# Altium schematic sheet Smartfin Main PCBA GPS.SchDoc: GPS
size Tabloid; TOCFontName: Consolas; TOCFontSize: 24; TOCFontColor: 0; TOCFontAttributes: 0; TOCMaxLinesInTable: 25; TOCVerticalOffset: 200; TOCHorizontalOffset: 500; TOCHorizontalSeparation: 800; TOCVerticalSeparation: 30; TOCHorizTableSize: 640; Engineer: Amy Domino; DocumentNumber: 644-001-023; Revision: A; SheetNumber: 5; SheetTotal: 9; PageSetup: Record=PageOptions|CenterHorizontal=True|CenterVertical=True|PrintScale=0.96|XCorrection=1.00|YCorrection=1.00|PrintKind=0|BorderSize=5000000|LeftOffset=0|BottomOffset=0|Orientation=2|PaperLength=1000|PaperWidth=1000|Scale=100|PaperSource=7|PrintQuality=-4|MediaType=1|DitherType=10|PaperKind=11" x 17"|PrintScaleMode=1
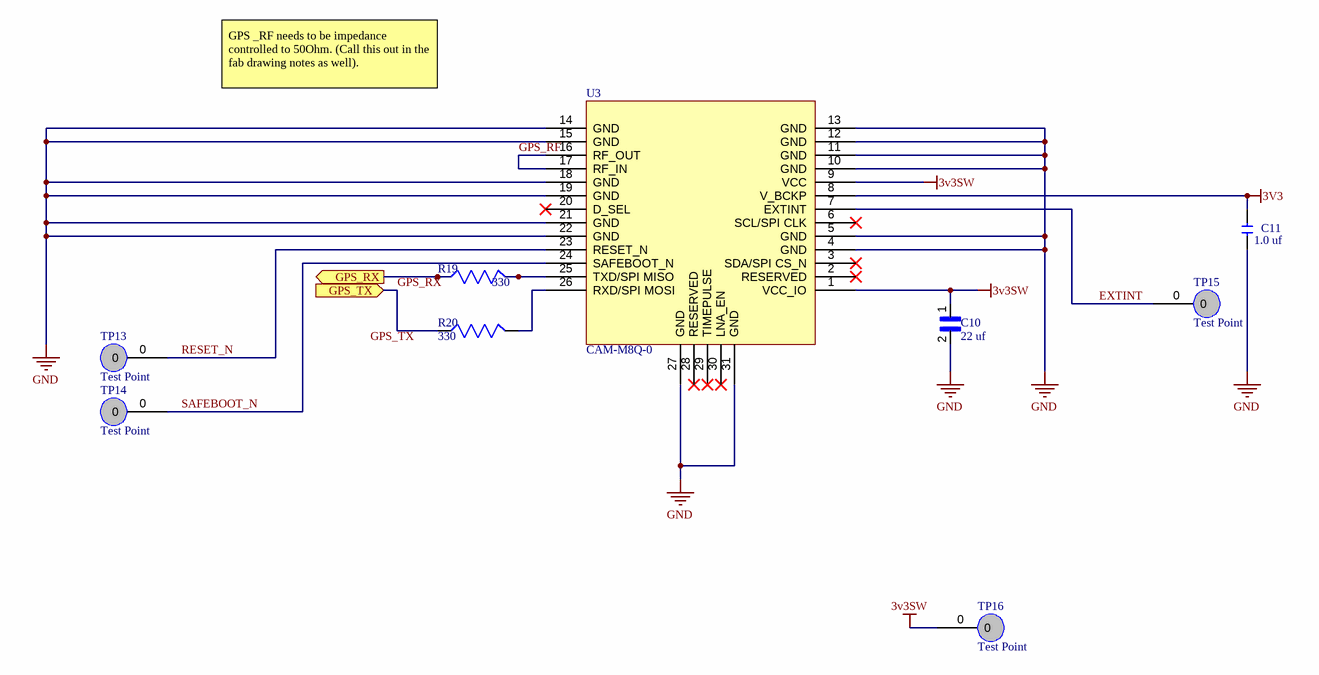
[diagram p0: Smartfin Main PCBA GPS.SchDoc]

## Parts
C10  value 22 uf  [CAPC1608X100N]  (hidden comment: GRM188R61A226ME15D)
C11  value 1.0 uf  [C0402]  (hidden comment: CERAMIC-1UF-10V-10%-X5R(0402))
R19  value 330  [RESC1005X40]  (hidden comment: RC0402JR-070RL)
R20  value 330  [RESC1005X40]  (hidden comment: RC0402JR-070RL)
TP13  Test Point  [New footprint 1]
TP14  Test Point  [New footprint 1]
TP15  Test Point  [New footprint 1]
TP16  Test Point  [New footprint 1]
U3  CAM-M8Q-0  [CAM-M8Q-0-Footprint-1]

## Ports
GPS_RX (out), GPS_TX (in)

## Nets
3V3: C11.2 U3.8(V_BCKP)
3v3SW: C10.1 TP16.0 U3.1(VCC_IO) U3.9(VCC)
GND: C10.2 C11.1 U3.4(GND) U3.5(GND) U3.10(GND) U3.11(GND) U3.12(GND) U3.13(GND) U3.14(GND) U3.15(GND) U3.18(GND) U3.19(GND) U3.21(GND) U3.22(GND) U3.27(GND) U3.31(GND)
EXTINT: TP15.0 U3.7(EXTINT)
GPS_RF: U3.16(RF_OUT) U3.17(RF_IN)
GPS_RX: R20.2 ; port GPS_TX
GPS_RX: R19.2 ; port GPS_RX  [a separate net that carries the same name]
RESET_N: TP13.0 U3.23(RESET_N)
SAFEBOOT_N: TP14.0 U3.24(SAFEBOOT_N)
NetR19_1: R19.1 U3.25(TXD/SPI_MISO)
NetR20_1: R20.1 U3.26(RXD/SPI_MOSI)

Not connected (* = marked no-connect by the designer): U3 2(RESERVED)* 3(SDA/SPI_CS_N)* 6(SCL/SPI_CLK)* 20(D_SEL)* 28(RESERVED)* 29(TIMEPULSE)* 30(LNA_EN)*

## Notes on the sheet
- GPS _RF needs to be impedance controlled to 50Ohm. (Call this out in the fab drawing notes as well).
- Labels drawn without touching a wire or pin: GPS_TX
- TITLE
- DOC NUMBER
- VARIANT
- REV
- 10875 dover st, suite 500
  westminster, co, 80021, usa
  syncroness.com
- FILE
- ENGINEER
- SHEET
- DATE
- OF
- THIS DOCUMENT IS CONFIDENTIAL AND THE PROPERTY OF SYNCRONESS, INC. AND ITS SUBSIDARIES. IT SHALL NOT BE REPRODUCED IN ANY MANNER NOR USED FOR ANY PURPOSE WHATSOEVER EXCEPT AS SPECIFIED IN WRITING BY SYNCRONESS, INC.

## Library data of the parts
C10 = CMP-002-000040-1: SMD Capacitor X5R(EIA) with Capacitance: 22uF Tol. 20%. Rated Voltage: 10Vdc; Component Type: Standard; Design Item ID: GRM188R61A226ME15D; Source: GRM188R61A226ME15D.SchLib; Availability: Unavailable; Pin Count: 2; Package: None; MP: GRM188R61A226ME15D; Price: None
C11 = CMP-002-000030-1: 1ÂµF Â±10% 10V Ceramic Capacitor X5R 0402 _1005 Metric_; MP: CC0402KRX5R6BB105; MF: Yageo; Pin Count: 2; Package: 0402 Yageo; SnapEDA_Link: https://www.snapeda.com/parts/CC0402KRX5R6BB105/Yageo/view-part/105546/?ref=snap; Availability: Unavailable; Source: SnapEDAsch.SchLib; Design Item ID: CERAMIC-1UF-10V-10%-X5R(0402); Price: None; Component Type: Standard
R19 R20 = CMP-002-000039-1: 0 Ohms Jumper 0.063W, 1/16W Chip Resistor 0402 (1005 Metric) Moisture Resistant Thick Film; MF: Yageo; Package: 0402 Yageo; Purchase-URL: https://pricing.snapeda.com/search/part/RC0402JR-070RL/?ref=eda; SnapEDA_Link: https://www.snapeda.com/parts/RC0402JR-070RL/Yageo/view-part/?ref=snap; Pin Count: 2; MP: RC0402JR-070RL; Design Item ID: RC0402JR-070RL; Source: RC0402JR-070RL.SchLib; Digi-Key_Part_Number: 311-0.0JRTR-ND; Component Type: Standard
TP13-TP16 = CMP-00002-2
U3 = CMP-23691-A.8: RF RCVR GNSS/GPS 1.575GHZ MODULE; Manufacturer: U-Blox; Interface: SPI,UART; Sensitivity: -167dBm; Current - Receiving: 29mA; Case/Package: SMD/SMT; Min Operating Temperature: -40°C; Max Operating Temperature: 85°C; Packaging: Tape and Reel; Frequency: 1.575GHz; Manufacturer Part Number: CAM-M8Q-0; Supplier: Digi-Key; Supplier Part Number: 672-CAM-M8Q-0-10CT-ND